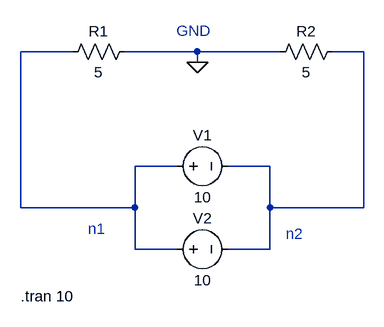
[diagram p0: schematic tc6.asc]
tc6.asc, the LTspice schematic file:
Version 4
SHEET 1 880 680
WIRE 32 0 -48 0
WIRE 224 0 112 0
WIRE 352 0 224 0
WIRE 480 0 432 0
WIRE 224 16 224 0
WIRE 192 176 128 176
WIRE 336 176 272 176
WIRE -48 240 -48 0
WIRE 128 240 128 176
WIRE 128 240 -48 240
WIRE 336 240 336 176
WIRE 480 240 480 0
WIRE 480 240 336 240
WIRE 128 304 128 240
WIRE 192 304 128 304
WIRE 336 304 336 240
WIRE 336 304 272 304
FLAG 224 16 0
SYMBOL voltage 176 176 R270
WINDOW 0 32 56 VTop 2
WINDOW 3 -32 56 VBottom 2
WINDOW 123 0 0 Left 0
WINDOW 39 0 0 Left 0
SYMATTR InstName V1
SYMATTR Value 10
SYMBOL voltage 176 304 R270
WINDOW 0 32 56 VTop 2
WINDOW 3 -32 56 VBottom 2
WINDOW 123 0 0 Left 0
WINDOW 39 0 0 Left 0
SYMATTR InstName V2
SYMATTR Value 10
SYMBOL res 128 -16 R90
WINDOW 0 0 56 VBottom 2
WINDOW 3 32 56 VTop 2
SYMATTR InstName R1
SYMATTR Value 5
SYMBOL res 448 -16 R90
WINDOW 0 0 56 VBottom 2
WINDOW 3 32 56 VTop 2
SYMATTR InstName R2
SYMATTR Value 5
TEXT -48 376 Left 2 !.tran 10
TEXT 56 272 Left 2 ;n1
TEXT 360 280 Left 2 ;n2
TEXT 192 -32 Left 2 ;GND

The netlist it stands for:
* tc6.asc
V1 N001 N002 10
V2 N001 N002 10
R1 0 N001 5
R2 N002 0 5
.tran 10
* n1
* n2
* GND
.backanno
.end